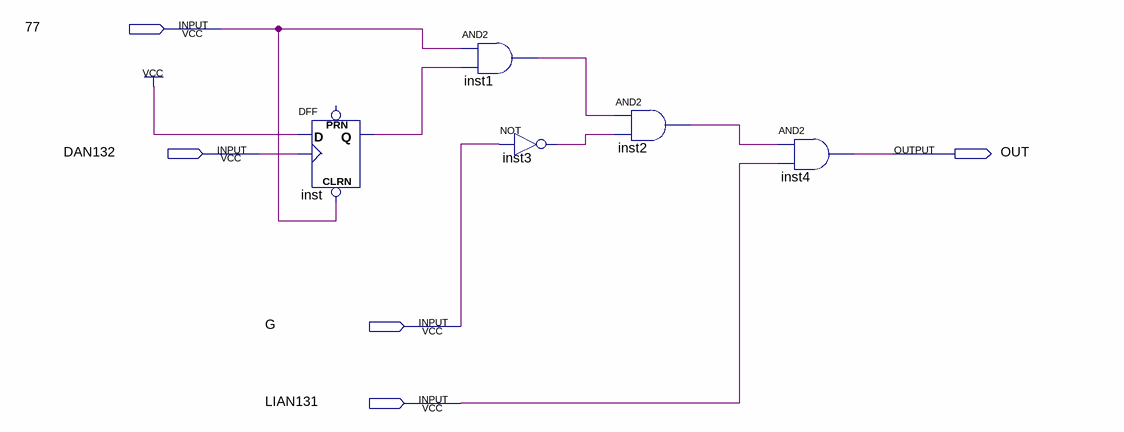
[diagram p0: schematic sheet]
// Quartus schematic kaiguan.bdf as structural Verilog: 5 symbols, 5 pins
module kaiguan (
  input  \77 ,
  input  DAN132,
  input  G,
  input  LIAN131,
  output OUT
);

  wire inst1_out, inst2_out, inst3_out, inst_q;

  DFF inst (.CLRN(\77 ), .CLK(DAN132), .D(1'b1), .Q(inst_q));  // open: PRN
  and inst1 (inst1_out, \77 , inst_q);
  not inst3 (inst3_out, G);
  and inst2 (inst2_out, inst1_out, inst3_out);
  and inst4 (OUT, inst2_out, LIAN131);
endmodule
